# EAGLE design PowerSystem - v.1.0  (EAGLE 9.5.2)
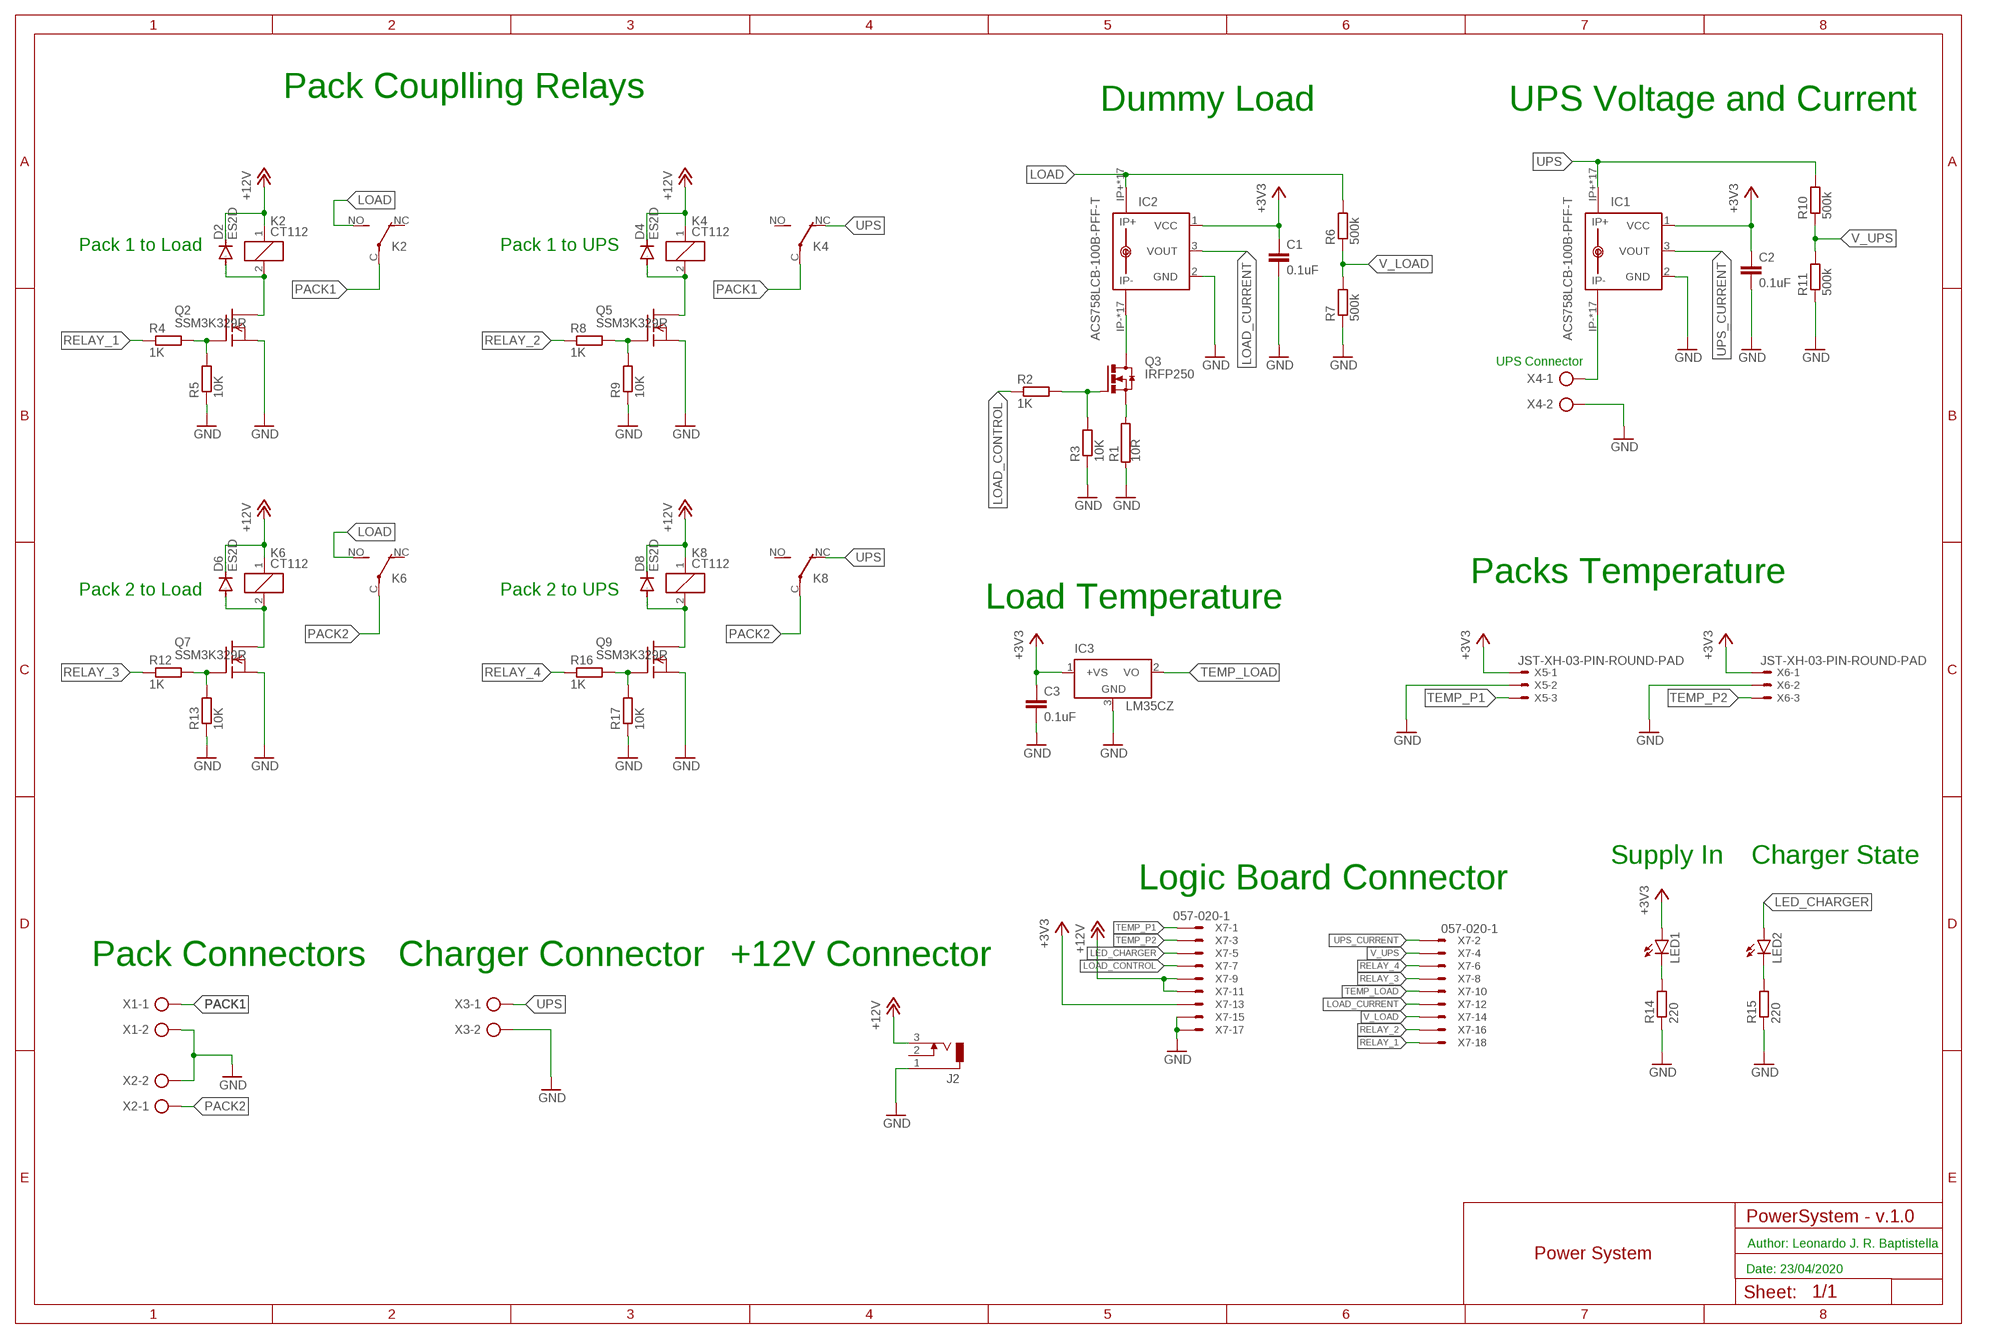
[diagram p0: schematic, sheet 1]

## Parts
C1  0.1uF  C-EUC1206  [C1206]
C2  0.1uF  C-EUC1206  [C1206]
C3  0.1uF  C-EUC1206  [C1206]
D2  ES2D  [SMB]
D4  ES2D  [SMB]
D6  ES2D  [SMB]
D8  ES2D  [SMB]
IC1  ACS758LCB-100B-PFF-T  [CB-PFF]
IC2  ACS758LCB-100B-PFF-T  [CB-PFF]
IC3  LM35CZ  [TO92]
J2  DCJ0303  [DCJ0303]
K2  CT112  [CT-SLIM]
K4  CT112  [CT-SLIM]
K6  CT112  [CT-SLIM]
K8  CT112  [CT-SLIM]
LED1  LEDCHIPLED_1206  [CHIPLED_1206]
LED2  LEDCHIPLED_1206  [CHIPLED_1206]
Q2  SSM3K329R  [SOT23]
Q3  IRFP250  [TO-247AD-V]
Q5  SSM3K329R  [SOT23]
Q7  SSM3K329R  [SOT23]
Q9  SSM3K329R  [SOT23]
R1  10R  RHS25  [HS25]
R2  1K  R-EU_R1206  [R1206]
R3  10K  R-EU_R1206  [R1206]
R4  1K  R-EU_R1206  [R1206]
R5  10K  R-EU_R1206  [R1206]
R6  500k  R-EU_R1206  [R1206]
R7  500k  R-EU_R1206  [R1206]
R8  1K  R-EU_R1206  [R1206]
R9  10K  R-EU_R1206  [R1206]
R10  500k  R-EU_R1206  [R1206]
R11  500k  R-EU_R1206  [R1206]
R12  1K  R-EU_R1206  [R1206]
R13  10K  R-EU_R1206  [R1206]
R14  220  R-EU_R1206  [R1206]
R15  220  R-EU_R1206  [R1206]
R16  1K  R-EU_R1206  [R1206]
R17  10K  R-EU_R1206  [R1206]
X1  AK500/2-H  [AK500/2-H]
X2  AK500/2-H  [AK500/2-H]
X3  AK500/2-H  [AK500/2-H]
X4  AK500/2-H  [AK500/2-H]
X5  JST-XH-03-PIN-ROUND-PAD  [JST-XH-03-PACKAGE-ROUND-PAD]
X6  JST-XH-03-PIN-ROUND-PAD  [JST-XH-03-PACKAGE-ROUND-PAD]
X7  057-020-1  [057-020-1]

## Nets
+3V3: C1.1 C2.1 C3.1 IC1.1(VCC) IC2.1(VCC) IC3.1(+VS) LED1.A X5.1 X6.1 X7.13
+12V: D2.C D4.C D6.C D8.C J2.3 K2.1 K4.1 K6.1 K8.1 X7.9 X7.11
GND: C1.2 C2.2 C3.2 IC1.2(GND) IC2.2(GND) IC3.3(GND) J2.1 Q2.2(S) Q5.2(S) Q7.2(S) Q9.2(S) R1.1 R3.1 R5.1 R7.1 R9.1 R11.1 R13.1 R14.1 R15.1 R17.1 X1.2 X2.2 X3.2 X4.2 X5.2 X6.2 X7.15 X7.17
LED_CHARGER: LED2.A X7.5
LOAD: IC2.IP+ IC2.IP+@2(IP+) IC2.IP+@3(IP+) IC2.IP+@4(IP+) IC2.IP+@5(IP+) IC2.IP+@6(IP+) IC2.IP+@7(IP+) IC2.IP+@8(IP+) IC2.IP+@9(IP+) IC2.IP+@10(IP+) IC2.IP+@11(IP+) IC2.IP+@12(IP+) IC2.IP+@13(IP+) IC2.IP+@14(IP+) IC2.IP+@15(IP+) IC2.IP+@16(IP+) IC2.IP+@17(IP+) K2.NO(2:S) K6.NO(2:S) R6.2
LOAD_CONTROL: R2.1 X7.7
LOAD_CURRENT: IC2.3(VOUT) X7.12
N$1: Q3.S R1.2
N$2: Q2.1(G) R4.2 R5.2
N$3: Q3.G R2.2 R3.2
N$4: D2.A K2.2 Q2.3(D)
N$5: IC2.IP- IC2.IP-@2(IP-) IC2.IP-@3(IP-) IC2.IP-@4(IP-) IC2.IP-@5(IP-) IC2.IP-@6(IP-) IC2.IP-@7(IP-) IC2.IP-@8(IP-) IC2.IP-@9(IP-) IC2.IP-@10(IP-) IC2.IP-@11(IP-) IC2.IP-@12(IP-) IC2.IP-@13(IP-) IC2.IP-@14(IP-) IC2.IP-@15(IP-) IC2.IP-@16(IP-) IC2.IP-@17(IP-) Q3.D
N$7: Q5.1(G) R8.2 R9.2
N$8: D4.A K4.2 Q5.3(D)
N$9: IC1.IP- IC1.IP-@2(IP-) IC1.IP-@3(IP-) IC1.IP-@4(IP-) IC1.IP-@5(IP-) IC1.IP-@6(IP-) IC1.IP-@7(IP-) IC1.IP-@8(IP-) IC1.IP-@9(IP-) IC1.IP-@10(IP-) IC1.IP-@11(IP-) IC1.IP-@12(IP-) IC1.IP-@13(IP-) IC1.IP-@14(IP-) IC1.IP-@15(IP-) IC1.IP-@16(IP-) IC1.IP-@17(IP-) X4.1
N$10: LED2.C R15.2
N$11: Q7.1(G) R12.2 R13.2
N$12: D6.A K6.2 Q7.3(D)
N$13: LED1.C R14.2
N$15: Q9.1(G) R16.2 R17.2
N$16: D8.A K8.2 Q9.3(D)
PACK1: K2.C(2:P) K4.C(2:P) X1.1
PACK2: K6.C(2:P) K8.C(2:P) X2.1
RELAY_1: R4.1 X7.18
RELAY_2: R8.1 X7.16
RELAY_3: R12.1 X7.8
RELAY_4: R16.1 X7.6
TEMP_LOAD: IC3.2(VO) X7.10
TEMP_P1: X5.3 X7.1
TEMP_P2: X6.3 X7.3
UPS: IC1.IP+ IC1.IP+@2(IP+) IC1.IP+@3(IP+) IC1.IP+@4(IP+) IC1.IP+@5(IP+) IC1.IP+@6(IP+) IC1.IP+@7(IP+) IC1.IP+@8(IP+) IC1.IP+@9(IP+) IC1.IP+@10(IP+) IC1.IP+@11(IP+) IC1.IP+@12(IP+) IC1.IP+@13(IP+) IC1.IP+@14(IP+) IC1.IP+@15(IP+) IC1.IP+@16(IP+) IC1.IP+@17(IP+) K4.NC(2:O) K8.NC(2:O) R10.2 X3.1
UPS_CURRENT: IC1.3(VOUT) X7.2
V_LOAD: R6.1 R7.2 X7.14
V_UPS: R10.1 R11.2 X7.4
Unconnected: J2.2 K2.NC(2:O) K4.NO(2:S) K6.NC(2:O) K8.NO(2:S) X7.19 X7.20

## Notes on the sheet
- Pack Couplling Relays
- Dummy Load | UPS Voltage and Current
- Pack 1 to Load | Pack 1 to UPS
- UPS Connector
- Packs Temperature
- Pack 2 to Load | Pack 2 to UPS
- Load Temperature
- Supply In | Charger State
- Logic Board Connector
- Pack Connectors | Charger Connector | +12V Connector
- Author: Leonardo J. R. Baptistella
- Power System
- Date: 23/04/2020

## Library data of the parts
C1-C3 = rcl:C-EU: CAPACITOR, European symbol; SPICEPREFIX: C
D2 D4 D6 D8 = diode:ES2D: DIODE super fast rectifier, 2 A
IC1 IC2 = allegro:ACS758*: Thermally Enhanced, Fully Integrated, Hall Effect-Based Linear Current Sensor with 100 micro Ohm Current Conductor display layer 49 Reference in BRD and place VIAs on circles Source: http://www.allegromicro.com/en/Products/Part_Numbers/0758/0758.pdf; MPN: ACS758LCB-100B-PFF-T; OC_FARNELL: 1718998; OC_NEWARK: 04R7132
IC3 = lm35:LM35: Single-Supply Centigrade Temperature Sensor Vout = (10mV/°C x Temp °C) +5mmmV Source: http://www.national.com/ds/LM/LM35.pdf
J2 = con-jack:DCJ0303: DC POWER JACK Source: DCJ0303.pdf
K2 K4 K6 K8 = relay:CT112: ULTRA SMALL AUTOMOTIVE RELAY NAiS Slim 1c type en_ds_61205_0000.pdf; OC_FARNELL: unknown; OC_NEWARK: unknown
LED1 LED2 = led:LED: LED OSRAM: - CHIPLED LG R971, LG N971, LY N971, LG Q971, LY Q971, LO R971, LY R971 LH N974, LH R974 LS Q976, LO Q976, LY Q976 LO Q996 - Hyper CHIPLED LW Q18S LB Q993, LB Q99A, LB R99A - SideLED LS A670, LO A670, LY A670, LG A670, LP A670 LB A673, LV A673, LT A673, LW A673 LH A674 LY A675 LS A676, LA A676, LO A676, LY A676, LW A676 LS A679, LY A679, LG A679 - Hyper Micro SIDELED® LS Y876, LA Y876, LO Y876, LY Y876 LT Y87S - SmartLED LW L88C, LW L88S LB L89C, LB L89S, LG L890 LS L89K, LO L89K, LY L89K LS L896, LA L896, LO L896, LY L896 - TOPLED LS T670, LO T670, LY T670, LG T670, LP T670 LSG T670, LSP T670, LSY T670, LOP T670, LYG T670 LG T671, LOG T671, LSG T671 LB T673, LV T673, LT T673, LW T673 LH T674 LS T676, LA T676, LO T676, LY T676, LB T676, LH T676, LSB T676, LW T676 LB T67C, LV T67C, LT T67C, LS T67K, LO T67K, LY T67K, LW E67C LS E67B, LA E67B, LO E67B, LY E67B, LB E67C, LV E67C, LT E67C LW T67C LS T679, LY T679, LG T679 LS T770, LO T770, LY T770, LG T770, LP T770 LB T773, LV T773, LT T773, LW T773 LH T774 LS E675, LA E675, LY E675, LS T675 LS T776, LA T776, LO T776, LY T776, LB T776 LHGB T686 LT T68C, LB T68C - Hyper Mini TOPLED® LB M676 - Mini TOPLED Santana® LG M470 LS M47K, LO M47K, LY M47K Source: http://www.osram.convergy.de LUXEON: - LUMILED® LXK2-PW12-R00, LXK2-PW12-S00, LXK2-PW14-U00, LXK2-PW14-V00 LXK2-PM12-R00, LXK2-PM12-S00, LXK2-PM14-U00 LXK2-PE12-Q00, LXK2-PE12-R00, LXK2-PE12-S00, LXK2-PE14-T00, LXK2-PE14-U00 LXK2-PB12-K00, LXK2-PB12-L00, LXK2-PB12-M00, LXK2-PB14-N00, LXK2-PB14-P00, LXK2-PB14-Q00 LXK2-PR12-L00, LXK2-PR12-M00, LXK2-PR14-Q00, LXK2-PR14-R00 LXK2-PD12-Q00, LXK2-PD12-R00, LXK2-PD12-S00 LXK2-PH12-R00, LXK2-PH12-S00 LXK2-PL12-P00, LXK2-PL12-Q00, LXK2-PL12-R00 Source: www.luxeon.com KINGBRIGHT: KA-3528ASYC Source: www.kingbright.com
Q2 Q5 Q7 Q9 = SSM3K329R:SSM3K329R; AVAILABILITY: Unavailable; DESCRIPTION: N-Channel 60V 115mA (Tc) 225mW (Ta) Surface Mount SOT-23-3 (TO-236); MF: STMicroelectronics; MP: 2N7002; PACKAGE: SOT-23-3 Vishay; PRICE: None
Q3 = transistor-power:IRFP25*: 33A/27A, 200V/150V, 0.085/0.012 Ohm, N-Channel Power MOSFET Source: Fairchild Semiconductor Corporation
R1 = resistor-power:R: Power Resitor; MPN: RHS25K; OC_FARNELL: 1129876; OC_NEWARK: 13P6733
R2-R17 = rcl:R-EU_: RESISTOR, European symbol; SPICEPREFIX: R
X1-X4 = con-ptr500:AK500/2-H: CONNECTOR Aug. 2004 / PTR Meßtechnik: Die Bezeichnung der Serie AK505 wurde geändert. Es handelt sich hierbei um AK500 in horizontaler Ausführung.; OC_FARNELL: unknown; OC_NEWARK: unknown
X5 X6 = JST-XH-Zenith:JST-XH-03-PIN: JST XH Connector 2 Pin Wire to board connector. Pitch: 2,54 mm, (0.100") Number of pins: 3 Created by Rembrandt Electronics www.rembrandtelectronics.com
X7 = con-panduit:057-020-: CONNECTOR 20-pin series 057 contact pc board low profile headers; OC_FARNELL: unknown; OC_NEWARK: unknown

## Board
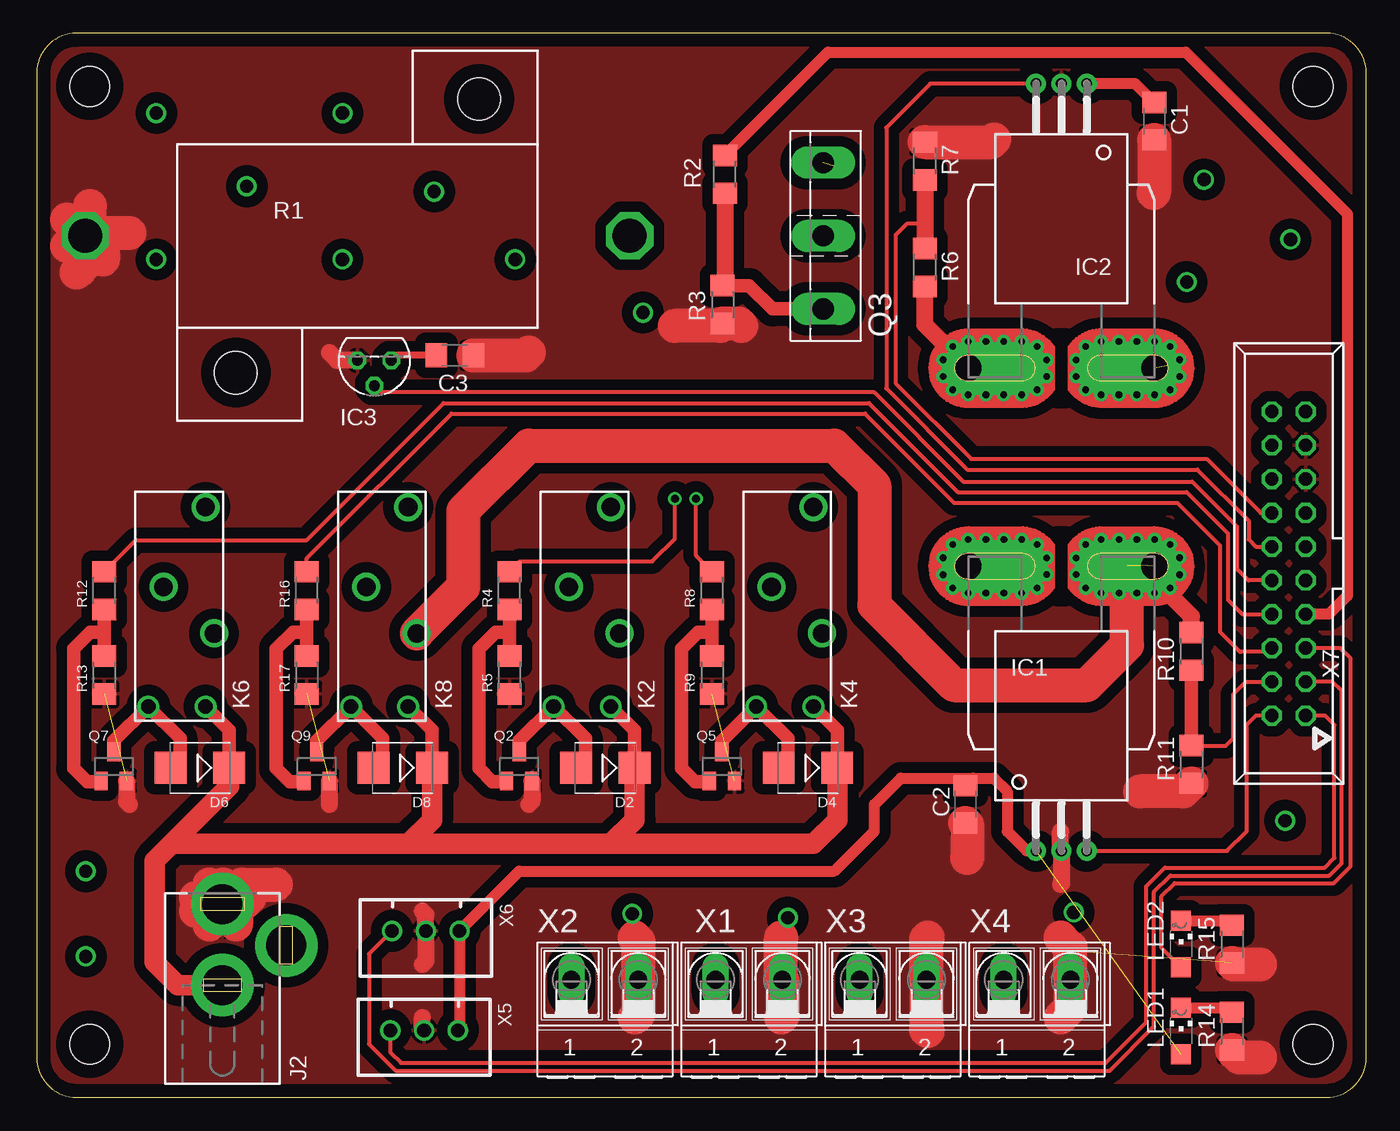
[diagram p1: board, top side]
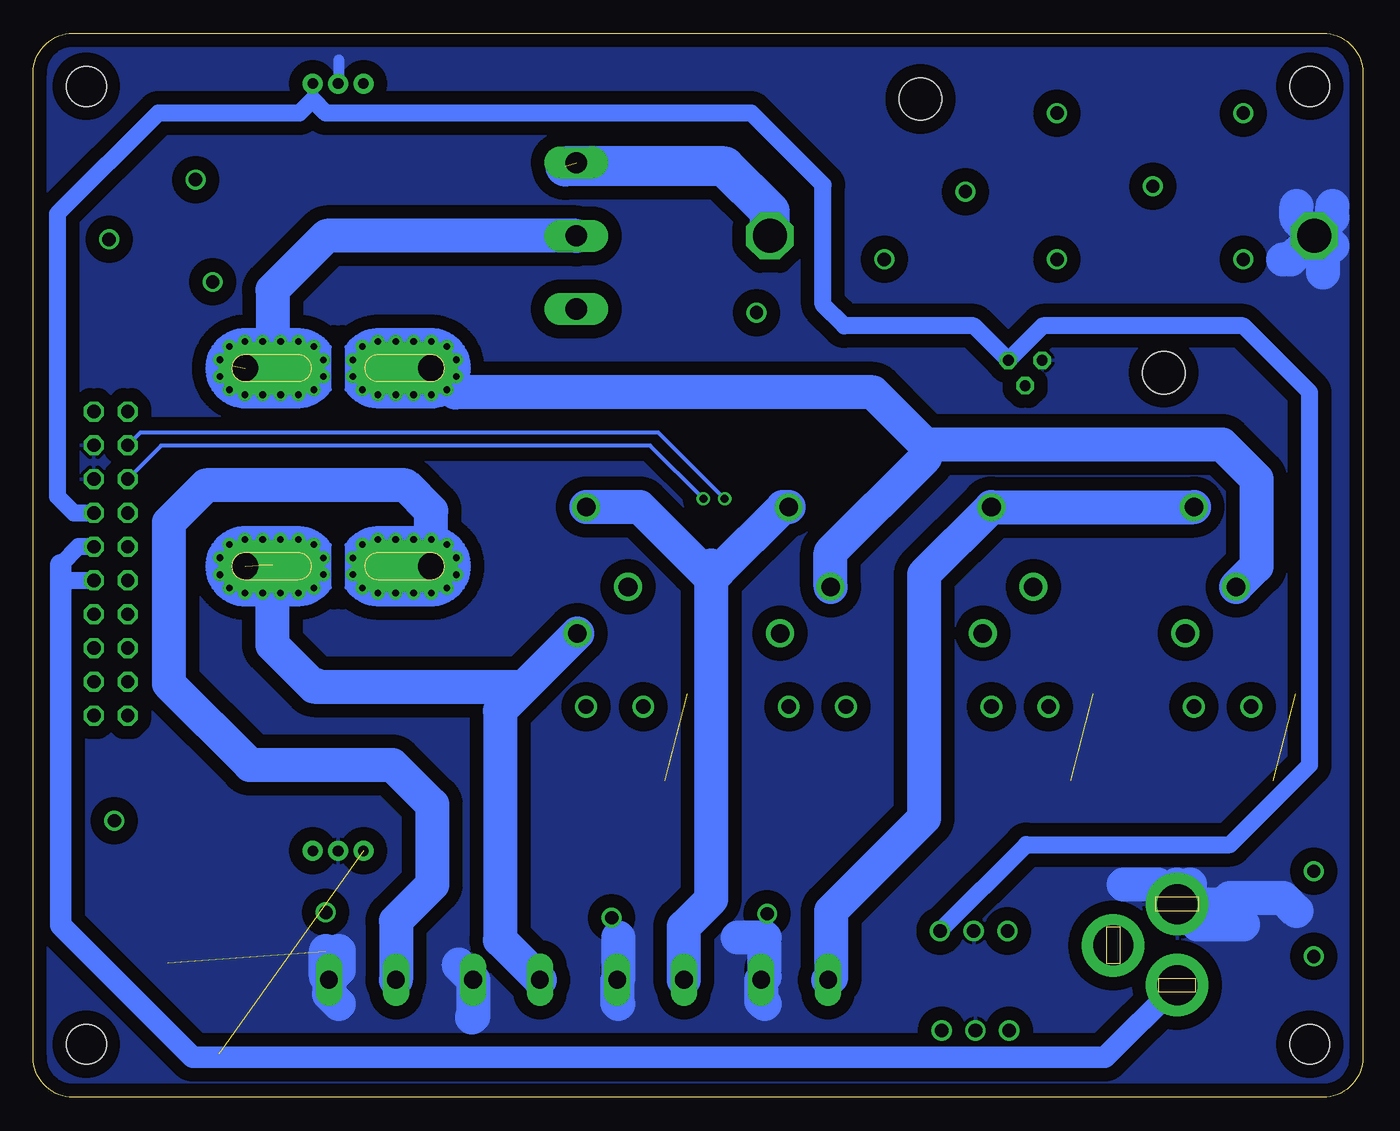
[diagram p2: board, bottom side, seen from below]

Size 100 x 80 mm. Coordinates in mm from the lower left corner, seen from the top.
Outline: 0,77 0,3 arc90 3,0 97,0 arc90 100,3 100,77 arc90 97,80 3,80 arc90 0,77
Copper layers (1*16): Top 0.035mm / dielectric 1.5mm / Bottom 0.035mm
Design rules "default": minimum track width 6mil, minimum drill 0.35mm, track to track 6mil, track to pad 6mil, pad to pad 6mil, via to via 6mil, smd to smd 6mil, copper to edge 40mil, drill to drill 6mil, minimum pad ring 10mil, minimum via ring 8mil, stop-mask expansion 4mil, vias tented up to drill 0mil, thermal gap 10mil
Holes 3 mm at 4,4 96,4 4,76 96,76

### Footprints (pad centres in the part's own frame; a part is rotated, then mirrored left to right if it is on the bottom)
C1206 = smd 1.6 x 1.8: 1 -1.4,0; 2 1.4,0
SMB = smd 2.4 x 2.4: A 2.2,0; C -2.2,0
CB-PFF = drill 0.8 pad 1.5: 1 -1.91,-21.4; 2 0,-21.4; 3 1.91,-21.4 | drill 2 pad 4 offset: IP+ 7,0; IP- -7,0 | drill 0.5 pad 0.9: IP+@2 8.89,0.635; IP+@3 8.89,-0.635; IP+@4 8.175,-1.625; IP+@5 7,-2; IP+@6 5.675,-2; IP+@7 4.35,-2; IP+@8 3,-2; IP+@9 1.825,-1.625; IP+@10 1.1,-0.625; IP+@11 1.1,0.625; IP+@12 1.825,1.625; IP+@13 3,2; IP+@14 4.35,2; IP+@15 5.675,2; IP+@16 7,2; IP+@17 8.175,1.625; IP-@2 -8.89,0.635; IP-@3 -8.89,-0.635; IP-@4 -8.175,-1.625; IP-@5 -7,-2; IP-@6 -5.675,-2; IP-@7 -4.325,-2; IP-@8 -3,-2; IP-@9 -1.825,-1.625; IP-@10 -1.1,-0.625; IP-@11 -1.1,0.625; IP-@12 -1.825,1.625; IP-@13 -3,2; IP-@14 -4.325,2; IP-@15 -5.675,2; IP-@16 -7,2; IP-@17 -8.175,1.625
TO92 = drill 0.813 octagon: 1 -1.27,0; 2 0,1.905; 3 1.27,0
DCJ0303 = drill 3 pad 4.7: 1 0,3.1; 2 4.8,0; 3 0,-3
CT-SLIM = drill 1.1: 1 -7.45,0; 2 -7.45,4.3 | drill 1.4: C 7.55,0; NC -1.95,-0.65; NO 1.55,3.15
CHIPLED_1206 = smd 1.5 x 1.5: A 0,-1.75; C 0,1.75
SOT23 = smd 1 x 1.4: 1 -0.95,-1.1; 2 0.95,-1.1; 3 0,1.1
TO-247AD-V = drill 1.6 long: D 0,-2.54; G -5.5,-2.54; S 5.5,-2.54
HS25 = drill 2.54 octagon: 1 -20.47,0; 2 20.47,0 | hole 3.2: 9.15,10.287; -9.15,-10.287
R1206 = smd 1.6 x 1.803: 1 -1.422,0; 2 1.422,0
AK500/2-H = drill 1.321 long: 1 -2.515,0; 2 2.515,0
JST-XH-03-PACKAGE-ROUND-PAD = drill 1.016: 1 -2.54,0; 2 0,0; 3 2.54,0
057-020-1 = drill 1 octagon: 1 -11.43,-1.27; 2 -11.43,1.27; 3 -8.89,-1.27; 4 -8.89,1.27; 5 -6.35,-1.27; 6 -6.35,1.27; 7 -3.81,-1.27; 8 -3.81,1.27; 9 -1.27,-1.27; 10 -1.27,1.27; 11 1.27,-1.27; 12 1.27,1.27; 13 3.81,-1.27; 14 3.81,1.27; 15 6.35,-1.27; 16 6.35,1.27; 17 8.89,-1.27; 18 8.89,1.27; 19 11.43,-1.27; 20 11.43,1.27

### Placement (x,y rotation side)
C1  84.06,73.39 270 top
C2  69.85,22.03 270 top
C3  31.46,55.78 0 top
D2  42.77,24.77 180 top
D4  58.01,24.77 180 top
D6  12.29,24.77 180 top
D8  27.53,24.77 180 top
IC1  77.07,39.93 0 top
IC2  77.07,54.82 180 top
IC3  25.4,55.41 180 top
J2  13.97,11.43 0 top
K2  43.18,36.83 90 top
K4  58.42,36.83 90 top
K6  12.7,36.83 90 top
K8  27.94,36.83 90 top
LED1  86.06,4.98 0 top
LED2  86.06,11.52 0 top
Q2  36.29,24.88 0 top
Q3  56.61,64.77 90 top
Q5  51.53,24.88 0 top
Q7  5.81,24.88 0 top
Q9  21.05,24.88 0 top
R1  24.13,64.77 0 top
R2  51.76,69.39 270 top
R3  51.59,59.61 90 top
R4  35.56,38.1 270 top
R5  35.56,31.75 90 top
R6  66.81,62.39 270 top
R7  66.81,70.39 270 top
R8  50.8,38.1 270 top
R9  50.8,31.75 90 top
R10  86.85,33.53 90 top
R11  86.85,25.03 90 top
R12  5.08,38.1 270 top
R13  5.08,31.75 90 top
R14  89.91,4.98 90 top
R15  89.91,11.52 90 top
R16  20.32,38.1 270 top
R17  20.32,31.75 90 top
X1  53.57,8.84 0 top
X2  42.74,8.84 0 top
X3  64.41,8.84 0 top
X4  75.24,8.84 0 top
X5  29.14,5.04 180 top
X6  29.27,12.51 180 top
X7  94.17,40.13 90 top

### Tracks (layer width: path | path; a pad name or v marks a point on that pad's centre or on a via)
+3V3  (1 unrouted)
  Top 0.508: C3.1 27.04,55.78 IC3.1
  Top 0.813: 31.81,5.16 X6.1 36.3,17 60,17 63,20 63,22 65,24 70.42,24 | C2.1 70.42,24 | 70.42,24 72,24 73,23 73,20 74.47,18.53 IC1.1 | C1.1 82.63,76.22 IC2.1
  Top 1.27: 31.81,5.16 X5.1
  Bottom 0.813: IC2.1 79,76.24 79,75 | IC3.1 26.67,55.67
  Bottom 1.27: X7.13 96.94,43.94 98.18,45.18 98.18,66.42 90.6,74 80,74 79,75 78,74 46,74 40.6,68.6 40.6,59.6 39,58 29.26,58 IC3.1 24.08,58 9,58 4,53 4,25 10,19 25.32,19 X6.1
+12V
  Top 1.016: D2.C 44.97,27.59 K2.1 | D4.C 60.21,27.59 K4.1 | D6.C 14.49,27.59 K6.1 | D8.C 29.73,27.59 K8.1
  Top 1.524: D6.C 14.49,23.38 10.16,19.05 | J2.3 10.62,8.43 8.89,10.16 8.89,17.78 10.16,19.05 | D8.C 29.73,20.84 27.94,19.05 | 10.16,19.05 27.94,19.05 | 27.94,19.05 43.18,19.05 | D2.C 44.97,20.84 43.18,19.05 | D4.C 60.21,20.84 58.42,19.05 43.18,19.05
  Bottom 1.27: 97.95,38.25 97.34,38.86 X7.9 | 97.95,40.05 96.6,41.4 X7.11
  Bottom 1.6: J2.3 19.4,3 88,3 97.95,12.95 97.95,38.25 97.95,40.05
GND  (4 unrouted)
  Top 1.27: R7.1 66.99,72 67,72 | 29,14 29.27,13.73 X6.2 29.27,10.27 29,10 | X5.2 29,5.18 29,6 | 77,20 77,18.6 IC1.2 77.07,16.07 77,16 | Q2.2 37.24,22.24 37,22 | Q9.2 22,22 | Q7.2 6.76,22.24 7,22 | IC3.3 22.59,55.41 22,56
  Top 2.54: J2.1 15.44,16 18,16 | J2.1 13,15.5 13,16 | J2.1 13.97,15.97 14,16 | J2.1 12.47,14.53 12,15 | J2.1 13.97,13.97 13,13 | J2.1 13.44,14 12,14 | J2.1 15,13.5 15,13 | J2.1 15.53,14.53 16,15 | 45,12 45.26,11.74 X2.2 45.26,6.25 45,6 | 56,12 56,8.93 X1.2 56.09,6.09 56,6 | 67,12 66.92,11.92 X3.2 66.92,5.08 67,5 | 77,12 77.75,11.25 X4.2 77.75,6.75 77,6 | 48,58 51.4,58 R3.1 52.81,58.19 53,58 | R7.1 71.81,71.81 72,72 | C1.2 84.06,68.06 84,68 | R11.1 86.24,23 83,23 | C2.2 70,20.48 70,18 | R15.1 90.01,10 92,10 | R14.1 90.46,3 92,3 | C3.2 36.78,55.78 37,56 | R1.1 3.89,65 7,65 | R1.1 3.66,62.66 3,62 | R1.1 3.52,64.77 2.29,66 | R1.1 4,65.11 4,67 | R1.1 2.89,64 2.29,64 | R1.1 5,63.43 5,63
  Bottom 0.813: IC2.2 77,76.29 77,78
  Bottom 2.54: J2.1 10.47,14.53 10,15 6,15 5,14 | J2.1 12.44,13 9,13 | J2.1 15.44,16 18,16 | J2.1 13.97,15.03 13,16 | J2.1 13.97,15.97 14,16 | 47,12 45,12 45,9.1 X2.2 45.26,7.25 45,7 | 56,12 56,8.93 X1.2 56.09,7.09 56,7 | 67,6 66.92,6.08 X3.2 68,9.92 68,10 | X4.2 78,9.09 78,11 | X4.2 77.75,7.75 77,7 | X4.2 77,9.59 77,11 | R1.1 3,64.11 3,62 | R1.1 5.43,63 6,63 | R1.1 5,66.11 5,67 | R1.1 2.29,66.14 2.29,67 | R1.1 2.89,64 2.29,64
  pour Top (isolate 0.813): 97,80 arc-90 100,77 100,5 100,3 arc-90 97,0 96,0 3,0 arc-90 0,3 0,77 arc-90 3,80 4,80
  pour Bottom (isolate 1.016): 1,80 97,80 arc-90 100,77 100,4 arc-90 96,0 3,0 arc-90 0,3 0,79 arc90
LED_CHARGER
  Top 0.305: LED2.A 84.6,11.24 84.6,15.1 85.6,16.1 97.55,16.1 98.83,17.38 98.83,33 98.05,33.78 X7.5
LOAD
  Top 1.27: IC2.IP+ 66.81,58.09 R6.2
  Bottom 2.54: K6.NO 8.01,39.92 8.01,46.49 10.59,49.07 32.91,49.07 | 32.91,49.07 36.84,53 68.25,53 IC2.IP+ | K2.NO 40.03,40.97 32.91,48.09 32.91,49.07
LOAD_CONTROL
  Top 0.813: R2.1 59.53,78.58 86.42,78.58 98.58,66.42 98.58,37.7 97.2,36.32 X7.7
LOAD_CURRENT
  Top 0.305: IC2.3 67.22,76.22 63.9,72.9 63.9,53.3 70,47.2 87.3,47.2 91.15,43.35 91.15,41.95 91.7,41.4 X7.12
N$1  (1 unrouted)
  Bottom 3: R1.2 44.6,66.6 48,70 60,70
N$2
  Top 1.016: 35.56,36.73 R4.2 35.56,34.98 | 35.56,34.98 R5.2 | Q2.1 35.29,23.73 34.27,23.73 33.27,24.73 33.27,33.73 34.52,34.98 35.56,34.98
N$3
  Top 0.813: 51.76,61.2 R3.2
  Top 1.016: Q3.G 55.35,59.27 53.59,61.03 R3.2
  Top 1.27: 58.35,59.27 Q3.G | R2.2 51.76,61.2
N$4
  Top 1.016: D2.A 41.27,25.46 41.27,26.99 K2.2 36.29,26.79 Q2.3
N$5  (1 unrouted)
  Bottom 2.54: Q3.D 77.93,64.77 82,60.7 82,55
  Bottom 3: 82,55 85,55
N$6  (via drill 1)
  other vias: 9,74
N$7
  Top 1.016: 50.8,36.73 R8.2 50.8,34.98 | 50.8,34.98 R9.2 | Q5.1 50.53,23.73 49.51,23.73 48.51,24.73 48.51,33.73 49.76,34.98 50.8,34.98
N$8
  Top 1.016: D4.A 56.51,25.46 56.51,26.99 K4.2 51.53,26.79 Q5.3
N$9
  Bottom 2.54: IC1.IP- 70.07,44.07 72,46 87,46 89.8,43.2 89.8,31.1 83.7,25 73,25 70,22 70,16 72.72,13.28 X4.1
N$10
  Top 0.813: LED2.C 89.58,13.27 R15.2
N$11
  Top 1.016: 5.08,36.73 R12.2 5.08,34.98 | 5.08,34.98 R13.2 | Q7.1 4.81,23.73 3.79,23.73 2.79,24.73 2.79,33.73 4.04,34.98 5.08,34.98
N$12
  Top 1.016: D6.A 10.79,25.46 10.79,26.99 K6.2 5.81,26.79 Q7.3
N$13
  Top 0.813: LED1.C 89.58,6.73 R14.2
N$14  (via drill 1)
  other vias: 23,74
N$15
  Top 1.016: 20.32,36.73 R16.2 20.32,34.98 | 20.32,34.98 R17.2 | Q9.1 20.05,23.73 19.03,23.73 18.03,24.73 18.03,33.73 19.28,34.98 20.32,34.98
N$16
  Top 1.016: D8.A 26.03,25.46 26.03,26.99 K8.2 21.05,26.79 Q9.3
N$17  (via drill 1)
  other vias: 9,63
N$18  (via drill 1)
  other vias: 23,63
N$19  (via drill 1)
  other vias: 36,63
N$20  (via drill 1)
  other vias: 15.8,68.5
N$21  (via drill 1)
  other vias: 29.9,68.1
N$22  (via drill 1)
  other vias: 45.6,59
N$23  (via drill 1)
  other vias: 87.8,69
N$24  (via drill 1)
  other vias: 94.3,64.5
N$25  (via drill 1)
  other vias: 86.5,61.3
N$26  (via drill 1)
  other vias: 93.9,20.8
N$27  (via drill 1)
  other vias: 78,13.9
N$28  (via drill 1)
  other vias: 56.5,13.5
N$29  (via drill 1)
  other vias: 44.8,13.8
N$30  (via drill 1)
  other vias: 3.7,17
N$31  (via drill 1)
  other vias: 3.7,10.6
PACK1
  Bottom 2.54: X1.1 51.06,12.84 49,14.9 49,39 | 49,39 49,40 48.5,39.5 43.62,44.38 K2.C | K4.C 54.38,44.38 50,40 49,39
PACK2
  Bottom 2.54: X2.1 40.16,8.84 40,9 40,14 33,21 33,39.32 K8.C K6.C
RELAY_1  (via drill 0.6)
  Top 0.305: R4.1 36.34,40.3 46.3,40.3 48,42 v48,45
  Bottom 0.305: v48,45 53,50 91.92,50 X7.18
RELAY_2  (via drill 0.6)
  Top 0.305: R8.1 49.6,40.72 v49.6,45
  Bottom 0.305: v49.6,45 53.6,49 90.38,49 X7.16
RELAY_3
  Top 0.305: R12.1 7.46,41.9 20.3,41.9 30.6,52.2 62.6,52.2 69.3,45.5 86.5,45.5 89.6,42.4 89.6,37.4 90.68,36.32 X7.8
RELAY_4
  Top 0.305: R16.1 20.32,40.52 31.2,51.4 62.3,51.4 69,44.7 85.8,44.7 89,41.5 89,35 90.5,33.5 92.62,33.5 X7.6
TEMP_LOAD
  Top 0.305: IC3.2 25.9,53.01 62.99,53.01 69.7,46.3 86.9,46.3 90.3,42.9 90.3,39.7 91.14,38.86 X7.10
TEMP_P1
  Top 0.305: X5.3 26.6,3.4 27.4,2.6 80.4,2.6 83.44,5.64 83.44,15.86 84.85,17.27 96.86,17.27 97.6,18 97.6,28 96.9,28.7 X7.1
TEMP_P2
  Top 0.305: X6.3 25,10.78 25,4 27,2 80.71,2 84.04,5.33 84.04,15.44 85.27,16.66 97.21,16.66 98.14,17.6 98.14,30.56 97.46,31.24 X7.3
UPS  (4 unrouted)
  Top 1.27: R10.2 86.85,36.15 84,39 83,39
  Top 2.54: K8.NC 32.09,38.38 32.09,44.09 37,49 60,49 63,46 63,37 69,31 79,31 82,34 82,40
  Bottom 2.54: 83,39 83,40 | 78.88,30.88 82,34 82,40 | X3.1 64.89,11.84 64.89,29.06 K4.NC 63.07,30.88 78.88,30.88 | 78.76,31 78.88,30.88
UPS_CURRENT
  Top 0.305: X7.2 91.7,28.7 91,28 91,20 89.53,18.53 IC1.3
V_LOAD
  Top 0.305: 66.81,65.7 65.5,65.7 64.6,64.8 64.6,53.7 70.3,48 88,48 92.06,43.94 X7.14
  Top 1.27: R7.2 66.81,65.7 R6.1
V_UPS
  Top 0.305: R11.2 89.45,26.45 90,27 90,30.3 90.94,31.24 X7.4
  Top 0.406: 86.96,32 R10.1
  Top 1.016: R10.1 R11.2